# EAGLE schematic ION-60 (EAGLE 6.5.0)
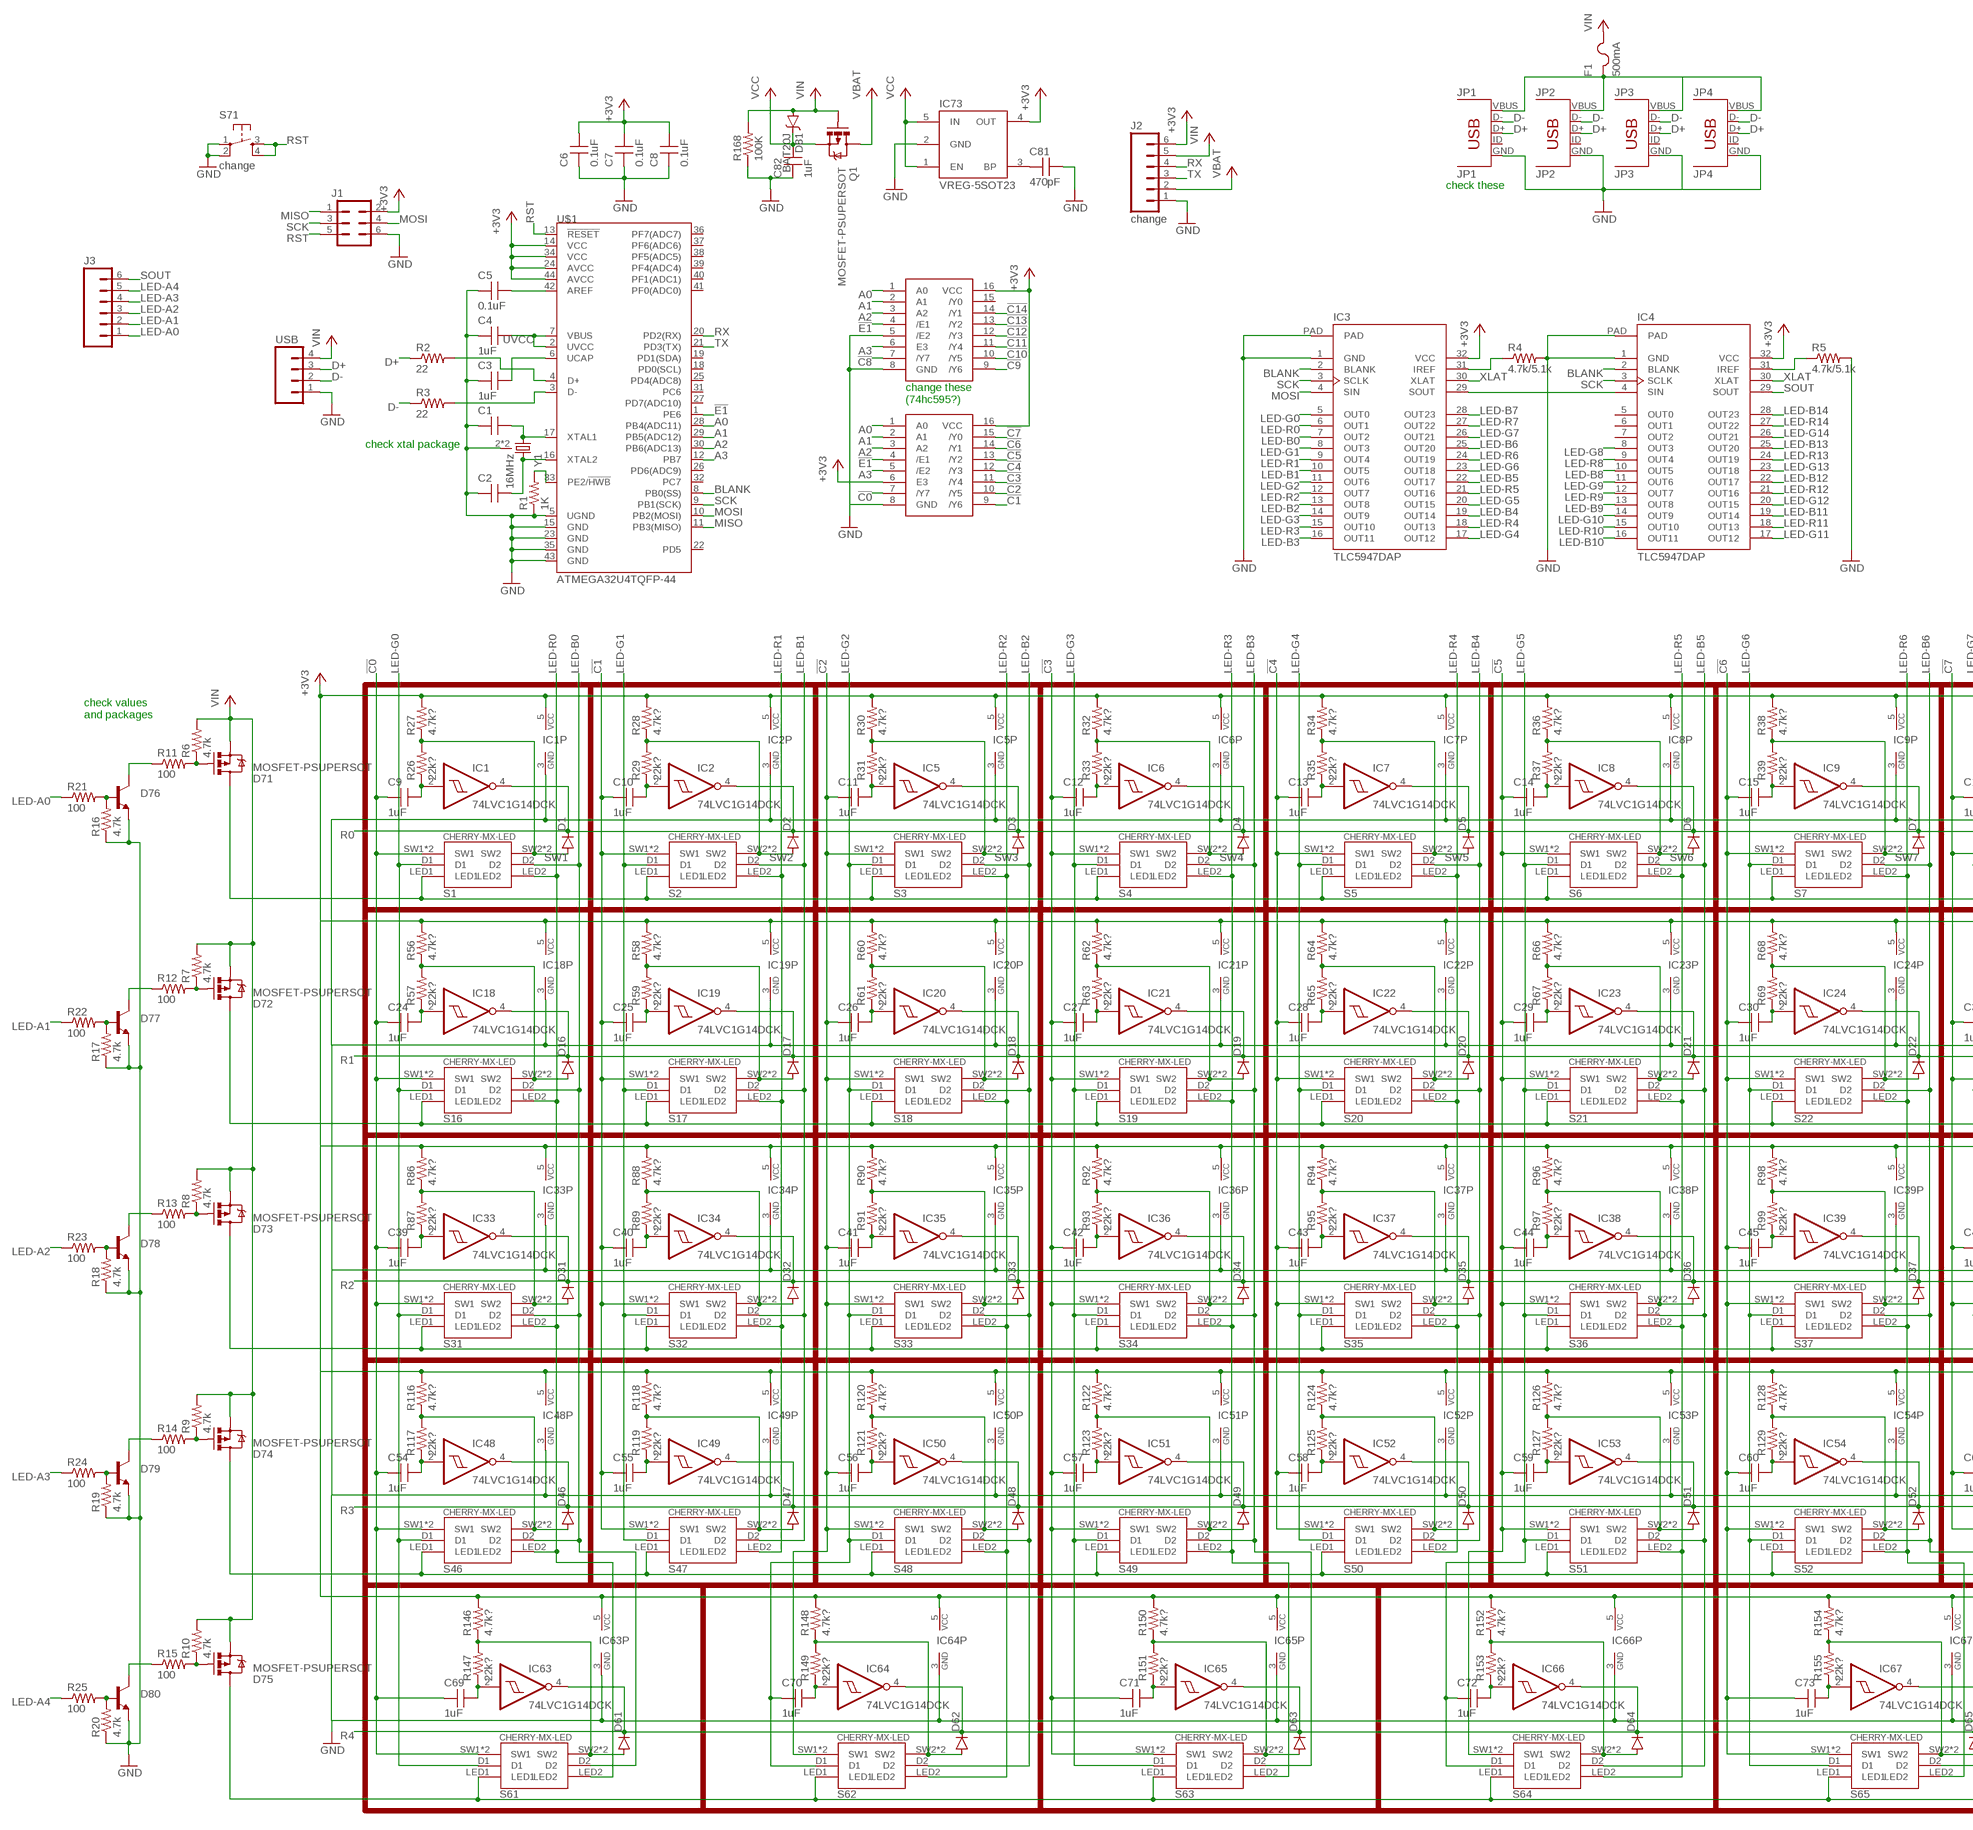
[diagram p0: schematic, sheet 1, part 1 of 2]
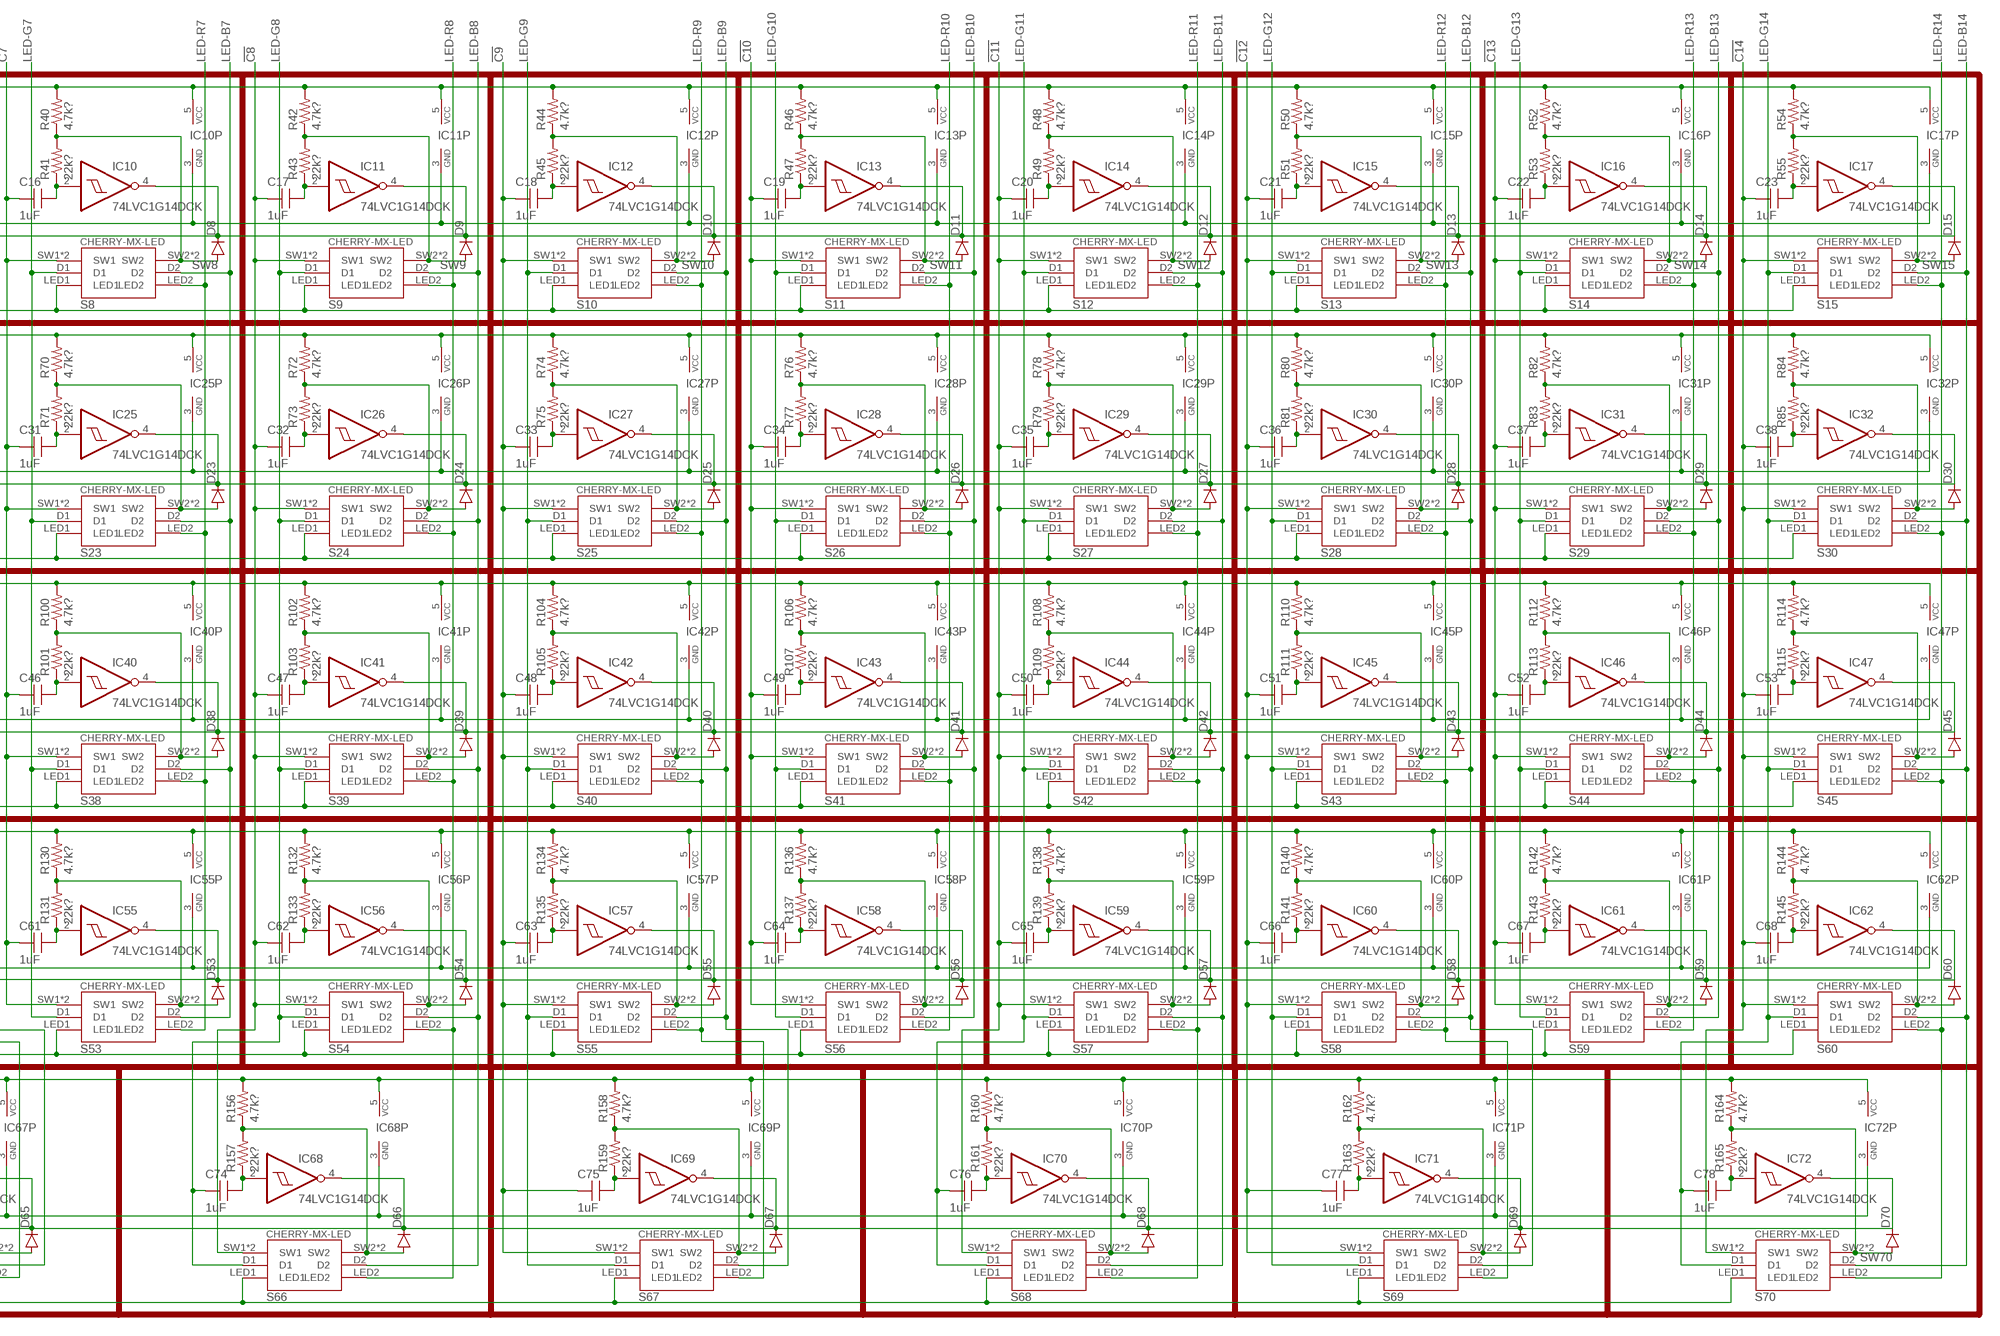
[diagram p1: schematic, sheet 1, part 2 of 2]

## Parts
C1  CAPACITOR0603  [C0603]
C2  CAPACITOR0603  [C0603]
C3  1uF  CAPACITOR0603  [C0603]
C4  1uF  CAPACITOR0603  [C0603]
C5  0.1uF  CAPACITOR0603  [C0603]
C6  0.1uF  CAPACITOR0603  [C0603]
C7  0.1uF  CAPACITOR0603  [C0603]
C8  0.1uF  CAPACITOR0603  [C0603]
C9  1uF  CAPACITOR0603  [C0603]
C10  1uF  CAPACITOR0603  [C0603]
C11  1uF  CAPACITOR0603  [C0603]
C12  1uF  CAPACITOR0603  [C0603]
C13  1uF  CAPACITOR0603  [C0603]
C14  1uF  CAPACITOR0603  [C0603]
C15  1uF  CAPACITOR0603  [C0603]
C16  1uF  CAPACITOR0603  [C0603]
C17  1uF  CAPACITOR0603  [C0603]
C18  1uF  CAPACITOR0603  [C0603]
C19  1uF  CAPACITOR0603  [C0603]
C20  1uF  CAPACITOR0603  [C0603]
C21  1uF  CAPACITOR0603  [C0603]
C22  1uF  CAPACITOR0603  [C0603]
C23  1uF  CAPACITOR0603  [C0603]
C24  1uF  CAPACITOR0603  [C0603]
C25  1uF  CAPACITOR0603  [C0603]
C26  1uF  CAPACITOR0603  [C0603]
C27  1uF  CAPACITOR0603  [C0603]
C28  1uF  CAPACITOR0603  [C0603]
C29  1uF  CAPACITOR0603  [C0603]
C30  1uF  CAPACITOR0603  [C0603]
C31  1uF  CAPACITOR0603  [C0603]
C32  1uF  CAPACITOR0603  [C0603]
C33  1uF  CAPACITOR0603  [C0603]
C34  1uF  CAPACITOR0603  [C0603]
C35  1uF  CAPACITOR0603  [C0603]
C36  1uF  CAPACITOR0603  [C0603]
C37  1uF  CAPACITOR0603  [C0603]
C38  1uF  CAPACITOR0603  [C0603]
C39  1uF  CAPACITOR0603  [C0603]
C40  1uF  CAPACITOR0603  [C0603]
C41  1uF  CAPACITOR0603  [C0603]
C42  1uF  CAPACITOR0603  [C0603]
C43  1uF  CAPACITOR0603  [C0603]
C44  1uF  CAPACITOR0603  [C0603]
C45  1uF  CAPACITOR0603  [C0603]
C46  1uF  CAPACITOR0603  [C0603]
C47  1uF  CAPACITOR0603  [C0603]
C48  1uF  CAPACITOR0603  [C0603]
C49  1uF  CAPACITOR0603  [C0603]
C50  1uF  CAPACITOR0603  [C0603]
C51  1uF  CAPACITOR0603  [C0603]
C52  1uF  CAPACITOR0603  [C0603]
C53  1uF  CAPACITOR0603  [C0603]
C54  1uF  CAPACITOR0603  [C0603]
C55  1uF  CAPACITOR0603  [C0603]
C56  1uF  CAPACITOR0603  [C0603]
C57  1uF  CAPACITOR0603  [C0603]
C58  1uF  CAPACITOR0603  [C0603]
C59  1uF  CAPACITOR0603  [C0603]
C60  1uF  CAPACITOR0603  [C0603]
C61  1uF  CAPACITOR0603  [C0603]
C62  1uF  CAPACITOR0603  [C0603]
C63  1uF  CAPACITOR0603  [C0603]
C64  1uF  CAPACITOR0603  [C0603]
C65  1uF  CAPACITOR0603  [C0603]
C66  1uF  CAPACITOR0603  [C0603]
C67  1uF  CAPACITOR0603  [C0603]
C68  1uF  CAPACITOR0603  [C0603]
C69  1uF  CAPACITOR0603  [C0603]
C70  1uF  CAPACITOR0603  [C0603]
C71  1uF  CAPACITOR0603  [C0603]
C72  1uF  CAPACITOR0603  [C0603]
C73  1uF  CAPACITOR0603  [C0603]
C74  1uF  CAPACITOR0603  [C0603]
C75  1uF  CAPACITOR0603  [C0603]
C76  1uF  CAPACITOR0603  [C0603]
C77  1uF  CAPACITOR0603  [C0603]
C78  1uF  CAPACITOR0603  [C0603]
C81  470pF  CAPACITOR0603  [C0603]
C82  1uF  CAPACITOR0603  [C0603]
D1  DIODESOD123  [SOD-123]
D2  DIODESOD123  [SOD-123]
D3  DIODESOD123  [SOD-123]
D4  DIODESOD123  [SOD-123]
D5  DIODESOD123  [SOD-123]
D6  DIODESOD123  [SOD-123]
D7  DIODESOD123  [SOD-123]
D8  DIODESOD123  [SOD-123]
D9  DIODESOD123  [SOD-123]
D10  DIODESOD123  [SOD-123]
D11  DIODESOD123  [SOD-123]
D12  DIODESOD123  [SOD-123]
D13  DIODESOD123  [SOD-123]
D14  DIODESOD123  [SOD-123]
D15  DIODESOD123  [SOD-123]
D16  DIODESOD123  [SOD-123]
D17  DIODESOD123  [SOD-123]
D18  DIODESOD123  [SOD-123]
D19  DIODESOD123  [SOD-123]
D20  DIODESOD123  [SOD-123]
D21  DIODESOD123  [SOD-123]
D22  DIODESOD123  [SOD-123]
D23  DIODESOD123  [SOD-123]
D24  DIODESOD123  [SOD-123]
D25  DIODESOD123  [SOD-123]
D26  DIODESOD123  [SOD-123]
D27  DIODESOD123  [SOD-123]
D28  DIODESOD123  [SOD-123]
D29  DIODESOD123  [SOD-123]
D30  DIODESOD123  [SOD-123]
D31  DIODESOD123  [SOD-123]
D32  DIODESOD123  [SOD-123]
D33  DIODESOD123  [SOD-123]
D34  DIODESOD123  [SOD-123]
D35  DIODESOD123  [SOD-123]
D36  DIODESOD123  [SOD-123]
D37  DIODESOD123  [SOD-123]
D38  DIODESOD123  [SOD-123]
D39  DIODESOD123  [SOD-123]
D40  DIODESOD123  [SOD-123]
D41  DIODESOD123  [SOD-123]
D42  DIODESOD123  [SOD-123]
D43  DIODESOD123  [SOD-123]
D44  DIODESOD123  [SOD-123]
D45  DIODESOD123  [SOD-123]
D46  DIODESOD123  [SOD-123]
D47  DIODESOD123  [SOD-123]
D48  DIODESOD123  [SOD-123]
D49  DIODESOD123  [SOD-123]
D50  DIODESOD123  [SOD-123]
D51  DIODESOD123  [SOD-123]
D52  DIODESOD123  [SOD-123]
D53  DIODESOD123  [SOD-123]
D54  DIODESOD123  [SOD-123]
D55  DIODESOD123  [SOD-123]
D56  DIODESOD123  [SOD-123]
D57  DIODESOD123  [SOD-123]
D58  DIODESOD123  [SOD-123]
D59  DIODESOD123  [SOD-123]
D60  DIODESOD123  [SOD-123]
D61  DIODESOD123  [SOD-123]
D62  DIODESOD123  [SOD-123]
D63  DIODESOD123  [SOD-123]
D64  DIODESOD123  [SOD-123]
D65  DIODESOD123  [SOD-123]
D66  DIODESOD123  [SOD-123]
D67  DIODESOD123  [SOD-123]
D68  DIODESOD123  [SOD-123]
D69  DIODESOD123  [SOD-123]
D70  DIODESOD123  [SOD-123]
D71  MOSFET-PSUPERSOT  [SUPERSOT-3]
D72  MOSFET-PSUPERSOT  [SUPERSOT-3]
D73  MOSFET-PSUPERSOT  [SUPERSOT-3]
D74  MOSFET-PSUPERSOT  [SUPERSOT-3]
D75  MOSFET-PSUPERSOT  [SUPERSOT-3]
D76  BSS138SOT23  [SOT23]
D77  BSS138SOT23  [SOT23]
D78  BSS138SOT23  [SOT23]
D79  BSS138SOT23  [SOT23]
D80  BSS138SOT23  [SOT23]
D81  BAT20J  DIODE-SCHOTTKY-BAT20J  [SOD-323]
F1  500mA  FUSESMD-1812  [FUSE-1812]
IC1  74LVC1G14DCK  [SC70-5]
IC2  74LVC1G14DCK  [SC70-5]
IC3  TLC5947DAP  [HTSSOP-32]
IC4  TLC5947DAP  [HTSSOP-32]
IC5  74LVC1G14DCK  [SC70-5]
IC6  74LVC1G14DCK  [SC70-5]
IC7  74LVC1G14DCK  [SC70-5]
IC8  74LVC1G14DCK  [SC70-5]
IC9  74LVC1G14DCK  [SC70-5]
IC10  74LVC1G14DCK  [SC70-5]
IC11  74LVC1G14DCK  [SC70-5]
IC12  74LVC1G14DCK  [SC70-5]
IC13  74LVC1G14DCK  [SC70-5]
IC14  74LVC1G14DCK  [SC70-5]
IC15  74LVC1G14DCK  [SC70-5]
IC16  74LVC1G14DCK  [SC70-5]
IC17  74LVC1G14DCK  [SC70-5]
IC18  74LVC1G14DCK  [SC70-5]
IC19  74LVC1G14DCK  [SC70-5]
IC20  74LVC1G14DCK  [SC70-5]
IC21  74LVC1G14DCK  [SC70-5]
IC22  74LVC1G14DCK  [SC70-5]
IC23  74LVC1G14DCK  [SC70-5]
IC24  74LVC1G14DCK  [SC70-5]
IC25  74LVC1G14DCK  [SC70-5]
IC26  74LVC1G14DCK  [SC70-5]
IC27  74LVC1G14DCK  [SC70-5]
IC28  74LVC1G14DCK  [SC70-5]
IC29  74LVC1G14DCK  [SC70-5]
IC30  74LVC1G14DCK  [SC70-5]
IC31  74LVC1G14DCK  [SC70-5]
IC32  74LVC1G14DCK  [SC70-5]
IC33  74LVC1G14DCK  [SC70-5]
IC34  74LVC1G14DCK  [SC70-5]
IC35  74LVC1G14DCK  [SC70-5]
IC36  74LVC1G14DCK  [SC70-5]
IC37  74LVC1G14DCK  [SC70-5]
IC38  74LVC1G14DCK  [SC70-5]
IC39  74LVC1G14DCK  [SC70-5]
IC40  74LVC1G14DCK  [SC70-5]
IC41  74LVC1G14DCK  [SC70-5]
IC42  74LVC1G14DCK  [SC70-5]
IC43  74LVC1G14DCK  [SC70-5]
IC44  74LVC1G14DCK  [SC70-5]
IC45  74LVC1G14DCK  [SC70-5]
IC46  74LVC1G14DCK  [SC70-5]
IC47  74LVC1G14DCK  [SC70-5]
IC48  74LVC1G14DCK  [SC70-5]
IC49  74LVC1G14DCK  [SC70-5]
IC50  74LVC1G14DCK  [SC70-5]
IC51  74LVC1G14DCK  [SC70-5]
IC52  74LVC1G14DCK  [SC70-5]
IC53  74LVC1G14DCK  [SC70-5]
IC54  74LVC1G14DCK  [SC70-5]
IC55  74LVC1G14DCK  [SC70-5]
IC56  74LVC1G14DCK  [SC70-5]
IC57  74LVC1G14DCK  [SC70-5]
IC58  74LVC1G14DCK  [SC70-5]
IC59  74LVC1G14DCK  [SC70-5]
IC60  74LVC1G14DCK  [SC70-5]
IC61  74LVC1G14DCK  [SC70-5]
IC62  74LVC1G14DCK  [SC70-5]
IC63  74LVC1G14DCK  [SC70-5]
IC64  74LVC1G14DCK  [SC70-5]
IC65  74LVC1G14DCK  [SC70-5]
IC66  74LVC1G14DCK  [SC70-5]
IC67  74LVC1G14DCK  [SC70-5]
IC68  74LVC1G14DCK  [SC70-5]
IC69  74LVC1G14DCK  [SC70-5]
IC70  74LVC1G14DCK  [SC70-5]
IC71  74LVC1G14DCK  [SC70-5]
IC72  74LVC1G14DCK  [SC70-5]
IC73  VREG-5SOT23  [SOT23-5]
J1  2X03M-0.1-PTH-SHROUDED  [M-2X03-0.1-PTH-SHROUDED]
J2  change  1X06M-0.05-PTH  [M-1X06-0.05-PTH]
J3  1X06M-0.1-PTH  [M-1X06-0.1-PTH]
JP1  USB-MICROBSMD  [USB-MICRO-B-SMD]
JP2  USB-MICROBSMD  [USB-MICRO-B-SMD]
JP3  USB-MICROBSMD  [USB-MICRO-B-SMD]
JP4  USB-MICROBSMD  [USB-MICRO-B-SMD]
Q1  MOSFET-PSUPERSOT  [SUPERSOT-3]
R1  1K  RESISTOR0603  [R0603]
R2  22  RESISTOR0603  [R0603]
R3  22  RESISTOR0603  [R0603]
R4  4.7k/5.1k  RESISTOR0603  [R0603]
R5  4.7k/5.1k  RESISTOR0603  [R0603]
R6  4.7k  RESISTOR0603  [R0603]
R7  4.7k  RESISTOR0603  [R0603]
R8  4.7k  RESISTOR0603  [R0603]
R9  4.7k  RESISTOR0603  [R0603]
R10  4.7k  RESISTOR0603  [R0603]
R11  100  RESISTOR0603  [R0603]
R12  100  RESISTOR0603  [R0603]
R13  100  RESISTOR0603  [R0603]
R14  100  RESISTOR0603  [R0603]
R15  100  RESISTOR0603  [R0603]
R16  4.7k  RESISTOR0603  [R0603]
R17  4.7k  RESISTOR0603  [R0603]
R18  4.7k  RESISTOR0603  [R0603]
R19  4.7k  RESISTOR0603  [R0603]
R20  4.7k  RESISTOR0603  [R0603]
R21  100  RESISTOR0603  [R0603]
R22  100  RESISTOR0603  [R0603]
R23  100  RESISTOR0603  [R0603]
R24  100  RESISTOR0603  [R0603]
R25  100  RESISTOR0603  [R0603]
R26  22k?  RESISTOR0603  [R0603]
R27  4.7k?  RESISTOR0603  [R0603]
R28  4.7k?  RESISTOR0603  [R0603]
R29  22k?  RESISTOR0603  [R0603]
R30  4.7k?  RESISTOR0603  [R0603]
R31  22k?  RESISTOR0603  [R0603]
R32  4.7k?  RESISTOR0603  [R0603]
R33  22k?  RESISTOR0603  [R0603]
R34  4.7k?  RESISTOR0603  [R0603]
R35  22k?  RESISTOR0603  [R0603]
R36  4.7k?  RESISTOR0603  [R0603]
R37  22k?  RESISTOR0603  [R0603]
R38  4.7k?  RESISTOR0603  [R0603]
R39  22k?  RESISTOR0603  [R0603]
R40  4.7k?  RESISTOR0603  [R0603]
R41  22k?  RESISTOR0603  [R0603]
R42  4.7k?  RESISTOR0603  [R0603]
R43  22k?  RESISTOR0603  [R0603]
R44  4.7k?  RESISTOR0603  [R0603]
R45  22k?  RESISTOR0603  [R0603]
R46  4.7k?  RESISTOR0603  [R0603]
R47  22k?  RESISTOR0603  [R0603]
R48  4.7k?  RESISTOR0603  [R0603]
R49  22k?  RESISTOR0603  [R0603]
R50  4.7k?  RESISTOR0603  [R0603]
R51  22k?  RESISTOR0603  [R0603]
R52  4.7k?  RESISTOR0603  [R0603]
R53  22k?  RESISTOR0603  [R0603]
R54  4.7k?  RESISTOR0603  [R0603]
R55  22k?  RESISTOR0603  [R0603]
R56  4.7k?  RESISTOR0603  [R0603]
R57  22k?  RESISTOR0603  [R0603]
R58  4.7k?  RESISTOR0603  [R0603]
R59  22k?  RESISTOR0603  [R0603]
R60  4.7k?  RESISTOR0603  [R0603]
R61  22k?  RESISTOR0603  [R0603]
R62  4.7k?  RESISTOR0603  [R0603]
R63  22k?  RESISTOR0603  [R0603]
R64  4.7k?  RESISTOR0603  [R0603]
R65  22k?  RESISTOR0603  [R0603]
R66  4.7k?  RESISTOR0603  [R0603]
R67  22k?  RESISTOR0603  [R0603]
R68  4.7k?  RESISTOR0603  [R0603]
R69  22k?  RESISTOR0603  [R0603]
R70  4.7k?  RESISTOR0603  [R0603]
R71  22k?  RESISTOR0603  [R0603]
R72  4.7k?  RESISTOR0603  [R0603]
R73  22k?  RESISTOR0603  [R0603]
R74  4.7k?  RESISTOR0603  [R0603]
R75  22k?  RESISTOR0603  [R0603]
R76  4.7k?  RESISTOR0603  [R0603]
R77  22k?  RESISTOR0603  [R0603]
R78  4.7k?  RESISTOR0603  [R0603]
R79  22k?  RESISTOR0603  [R0603]
R80  4.7k?  RESISTOR0603  [R0603]
R81  22k?  RESISTOR0603  [R0603]
R82  4.7k?  RESISTOR0603  [R0603]
R83  22k?  RESISTOR0603  [R0603]
R84  4.7k?  RESISTOR0603  [R0603]
R85  22k?  RESISTOR0603  [R0603]
R86  4.7k?  RESISTOR0603  [R0603]
R87  22k?  RESISTOR0603  [R0603]
R88  4.7k?  RESISTOR0603  [R0603]
R89  22k?  RESISTOR0603  [R0603]
R90  4.7k?  RESISTOR0603  [R0603]
R91  22k?  RESISTOR0603  [R0603]
R92  4.7k?  RESISTOR0603  [R0603]
R93  22k?  RESISTOR0603  [R0603]
R94  4.7k?  RESISTOR0603  [R0603]
R95  22k?  RESISTOR0603  [R0603]
R96  4.7k?  RESISTOR0603  [R0603]
R97  22k?  RESISTOR0603  [R0603]
R98  4.7k?  RESISTOR0603  [R0603]
R99  22k?  RESISTOR0603  [R0603]
R100  4.7k?  RESISTOR0603  [R0603]
R101  22k?  RESISTOR0603  [R0603]
R102  4.7k?  RESISTOR0603  [R0603]
R103  22k?  RESISTOR0603  [R0603]
R104  4.7k?  RESISTOR0603  [R0603]
R105  22k?  RESISTOR0603  [R0603]
R106  4.7k?  RESISTOR0603  [R0603]
R107  22k?  RESISTOR0603  [R0603]
R108  4.7k?  RESISTOR0603  [R0603]
R109  22k?  RESISTOR0603  [R0603]
R110  4.7k?  RESISTOR0603  [R0603]
R111  22k?  RESISTOR0603  [R0603]
R112  4.7k?  RESISTOR0603  [R0603]
R113  22k?  RESISTOR0603  [R0603]
R114  4.7k?  RESISTOR0603  [R0603]
R115  22k?  RESISTOR0603  [R0603]
R116  4.7k?  RESISTOR0603  [R0603]
R117  22k?  RESISTOR0603  [R0603]
R118  4.7k?  RESISTOR0603  [R0603]
R119  22k?  RESISTOR0603  [R0603]
R120  4.7k?  RESISTOR0603  [R0603]
R121  22k?  RESISTOR0603  [R0603]
R122  4.7k?  RESISTOR0603  [R0603]
R123  22k?  RESISTOR0603  [R0603]
R124  4.7k?  RESISTOR0603  [R0603]
R125  22k?  RESISTOR0603  [R0603]
R126  4.7k?  RESISTOR0603  [R0603]
R127  22k?  RESISTOR0603  [R0603]
R128  4.7k?  RESISTOR0603  [R0603]
R129  22k?  RESISTOR0603  [R0603]
R130  4.7k?  RESISTOR0603  [R0603]
R131  22k?  RESISTOR0603  [R0603]
R132  4.7k?  RESISTOR0603  [R0603]
R133  22k?  RESISTOR0603  [R0603]
R134  4.7k?  RESISTOR0603  [R0603]
R135  22k?  RESISTOR0603  [R0603]
R136  4.7k?  RESISTOR0603  [R0603]
R137  22k?  RESISTOR0603  [R0603]
R138  4.7k?  RESISTOR0603  [R0603]
R139  22k?  RESISTOR0603  [R0603]
R140  4.7k?  RESISTOR0603  [R0603]
R141  22k?  RESISTOR0603  [R0603]
R142  4.7k?  RESISTOR0603  [R0603]
R143  22k?  RESISTOR0603  [R0603]
R144  4.7k?  RESISTOR0603  [R0603]
R145  22k?  RESISTOR0603  [R0603]
R146  4.7k?  RESISTOR0603  [R0603]
R147  22k?  RESISTOR0603  [R0603]
R148  4.7k?  RESISTOR0603  [R0603]
R149  22k?  RESISTOR0603  [R0603]
R150  4.7k?  RESISTOR0603  [R0603]
R151  22k?  RESISTOR0603  [R0603]
R152  4.7k?  RESISTOR0603  [R0603]
R153  22k?  RESISTOR0603  [R0603]
R154  4.7k?  RESISTOR0603  [R0603]
R155  22k?  RESISTOR0603  [R0603]
R156  4.7k?  RESISTOR0603  [R0603]
R157  22k?  RESISTOR0603  [R0603]
R158  4.7k?  RESISTOR0603  [R0603]
R159  22k?  RESISTOR0603  [R0603]
R160  4.7k?  RESISTOR0603  [R0603]
R161  22k?  RESISTOR0603  [R0603]
R162  4.7k?  RESISTOR0603  [R0603]
R163  22k?  RESISTOR0603  [R0603]
R164  4.7k?  RESISTOR0603  [R0603]
R165  22k?  RESISTOR0603  [R0603]
R168  100K  RESISTOR0603  [R0603]
S1  CHERRY-MX-LED1X1  [CHERRY-MX-LED-1X1]
S2  CHERRY-MX-LED1X1  [CHERRY-MX-LED-1X1]
S3  CHERRY-MX-LED1X1  [CHERRY-MX-LED-1X1]
S4  CHERRY-MX-LED1X1  [CHERRY-MX-LED-1X1]
S5  CHERRY-MX-LED1X1  [CHERRY-MX-LED-1X1]
S6  CHERRY-MX-LED1X1  [CHERRY-MX-LED-1X1]
S7  CHERRY-MX-LED1X1  [CHERRY-MX-LED-1X1]
S8  CHERRY-MX-LED1X1  [CHERRY-MX-LED-1X1]
S9  CHERRY-MX-LED1X1  [CHERRY-MX-LED-1X1]
S10  CHERRY-MX-LED1X1  [CHERRY-MX-LED-1X1]
S11  CHERRY-MX-LED1X1  [CHERRY-MX-LED-1X1]
S12  CHERRY-MX-LED1X1  [CHERRY-MX-LED-1X1]
S13  CHERRY-MX-LED1X1  [CHERRY-MX-LED-1X1]
S14  CHERRY-MX-LED1X1  [CHERRY-MX-LED-1X1]
S15  CHERRY-MX-LED1X1  [CHERRY-MX-LED-1X1]
S16  CHERRY-MX-LED1X1  [CHERRY-MX-LED-1X1]
S17  CHERRY-MX-LED1X1  [CHERRY-MX-LED-1X1]
S18  CHERRY-MX-LED1X1  [CHERRY-MX-LED-1X1]
S19  CHERRY-MX-LED1X1  [CHERRY-MX-LED-1X1]
S20  CHERRY-MX-LED1X1  [CHERRY-MX-LED-1X1]
S21  CHERRY-MX-LED1X1  [CHERRY-MX-LED-1X1]
S22  CHERRY-MX-LED1X1  [CHERRY-MX-LED-1X1]
S23  CHERRY-MX-LED1X1  [CHERRY-MX-LED-1X1]
S24  CHERRY-MX-LED1X1  [CHERRY-MX-LED-1X1]
S25  CHERRY-MX-LED1X1  [CHERRY-MX-LED-1X1]
S26  CHERRY-MX-LED1X1  [CHERRY-MX-LED-1X1]
S27  CHERRY-MX-LED1X1  [CHERRY-MX-LED-1X1]
S28  CHERRY-MX-LED1X1  [CHERRY-MX-LED-1X1]
S29  CHERRY-MX-LED1X1  [CHERRY-MX-LED-1X1]
S30  CHERRY-MX-LED1X1  [CHERRY-MX-LED-1X1]
S31  CHERRY-MX-LED1X1  [CHERRY-MX-LED-1X1]
S32  CHERRY-MX-LED1X1  [CHERRY-MX-LED-1X1]
S33  CHERRY-MX-LED1X1  [CHERRY-MX-LED-1X1]
S34  CHERRY-MX-LED1X1  [CHERRY-MX-LED-1X1]
S35  CHERRY-MX-LED1X1  [CHERRY-MX-LED-1X1]
S36  CHERRY-MX-LED1X1  [CHERRY-MX-LED-1X1]
S37  CHERRY-MX-LED1X1  [CHERRY-MX-LED-1X1]
S38  CHERRY-MX-LED1X1  [CHERRY-MX-LED-1X1]
S39  CHERRY-MX-LED1X1  [CHERRY-MX-LED-1X1]
S40  CHERRY-MX-LED1X1  [CHERRY-MX-LED-1X1]
S41  CHERRY-MX-LED1X1  [CHERRY-MX-LED-1X1]
S42  CHERRY-MX-LED1X1  [CHERRY-MX-LED-1X1]
S43  CHERRY-MX-LED1X1  [CHERRY-MX-LED-1X1]
S44  CHERRY-MX-LED1X1  [CHERRY-MX-LED-1X1]
S45  CHERRY-MX-LED1X1  [CHERRY-MX-LED-1X1]
S46  CHERRY-MX-LED1X1  [CHERRY-MX-LED-1X1]
S47  CHERRY-MX-LED1X1  [CHERRY-MX-LED-1X1]
S48  CHERRY-MX-LED1X1  [CHERRY-MX-LED-1X1]
S49  CHERRY-MX-LED1X1  [CHERRY-MX-LED-1X1]
S50  CHERRY-MX-LED1X1  [CHERRY-MX-LED-1X1]
S51  CHERRY-MX-LED1X1  [CHERRY-MX-LED-1X1]
S52  CHERRY-MX-LED1X1  [CHERRY-MX-LED-1X1]
S53  CHERRY-MX-LED1X1  [CHERRY-MX-LED-1X1]
S54  CHERRY-MX-LED1X1  [CHERRY-MX-LED-1X1]
S55  CHERRY-MX-LED1X1  [CHERRY-MX-LED-1X1]
S56  CHERRY-MX-LED1X1  [CHERRY-MX-LED-1X1]
S57  CHERRY-MX-LED1X1  [CHERRY-MX-LED-1X1]
S58  CHERRY-MX-LED1X1  [CHERRY-MX-LED-1X1]
S59  CHERRY-MX-LED1X1  [CHERRY-MX-LED-1X1]
S60  CHERRY-MX-LED1X1  [CHERRY-MX-LED-1X1]
S61  CHERRY-MX-LED1X1.5  [CHERRY-MX-LED-1X1.5]
S62  CHERRY-MX-LED1X1.5  [CHERRY-MX-LED-1X1.5]
S63  CHERRY-MX-LED1X1.5  [CHERRY-MX-LED-1X1.5]
S64  CHERRY-MX-LED1X1.5  [CHERRY-MX-LED-1X1.5]
S65  CHERRY-MX-LED1X1.5  [CHERRY-MX-LED-1X1.5]
S66  CHERRY-MX-LED1X1.5  [CHERRY-MX-LED-1X1.5]
S67  CHERRY-MX-LED1X1.5  [CHERRY-MX-LED-1X1.5]
S68  CHERRY-MX-LED1X1.5  [CHERRY-MX-LED-1X1.5]
S69  CHERRY-MX-LED1X1.5  [CHERRY-MX-LED-1X1.5]
S70  CHERRY-MX-LED1X1.5  [CHERRY-MX-LED-1X1.5]
S71  change  SWITCH-TACTILESMD  [SWITCH-TACTILE-SMD]
U$1  ATMEGA32U4TQFP-44  [TQFP44]
U$2  74LVC138AD  [SO016]
U$3  74LVC138AD  [SO016]
USB  1X04M-0.1-PTH  [M-1X04-0.1-PTH]
Y1  16MHz  CRYSTAL  [CRYSTAL-SMD-3.2X2.5]

## Nets
!C0: C9.1 C24.1 C39.1 C54.1 C69.1 S1.SW1 S1.SW3(SW1) S16.SW1 S16.SW3(SW1) S31.SW1 S31.SW3(SW1) S46.SW1 S46.SW3(SW1) S61.SW1 S61.SW3(SW1) U$2.7(/Y7)
!C1: C10.1 C25.1 C40.1 C55.1 S2.SW1 S2.SW3(SW1) S17.SW1 S17.SW3(SW1) S32.SW1 S32.SW3(SW1) S47.SW1 S47.SW3(SW1) U$2.9(/Y6)
!C2: C11.1 C26.1 C41.1 C56.1 S3.SW1 S3.SW3(SW1) S18.SW1 S18.SW3(SW1) S33.SW1 S33.SW3(SW1) S48.SW1 S48.SW3(SW1) S62.SW1 S62.SW3(SW1) U$2.10(/Y5)
!C3: C12.1 C27.1 C42.1 C57.1 C71.1 S4.SW1 S4.SW3(SW1) S19.SW1 S19.SW3(SW1) S34.SW1 S34.SW3(SW1) S49.SW1 S49.SW3(SW1) S63.SW1 S63.SW3(SW1) U$2.11(/Y4)
!C4: C13.1 C28.1 C43.1 C58.1 S5.SW1 S5.SW3(SW1) S20.SW1 S20.SW3(SW1) S35.SW1 S35.SW3(SW1) S50.SW1 S50.SW3(SW1) U$2.12(/Y3)
!C5: C14.1 C29.1 C44.1 C59.1 S6.SW1 S6.SW3(SW1) S21.SW1 S21.SW3(SW1) S36.SW1 S36.SW3(SW1) S51.SW1 S51.SW3(SW1) S64.SW1 S64.SW3(SW1) U$2.13(/Y2)
!C6: C15.1 C30.1 C45.1 C60.1 C73.1 S7.SW1 S7.SW3(SW1) S22.SW1 S22.SW3(SW1) S37.SW1 S37.SW3(SW1) S52.SW1 S52.SW3(SW1) S65.SW1 S65.SW3(SW1) U$2.14(/Y1)
!C7: C16.1 C31.1 C46.1 C61.1 S8.SW1 S8.SW3(SW1) S23.SW1 S23.SW3(SW1) S38.SW1 S38.SW3(SW1) S53.SW1 S53.SW3(SW1) U$2.15(/Y0)
!C8: C17.1 C32.1 C47.1 C62.1 S9.SW1 S9.SW3(SW1) S24.SW1 S24.SW3(SW1) S39.SW1 S39.SW3(SW1) S54.SW1 S54.SW3(SW1) S66.SW1 S66.SW3(SW1) U$3.7(/Y7)
!C9: C18.1 C33.1 C48.1 C63.1 C75.1 S10.SW1 S10.SW3(SW1) S25.SW1 S25.SW3(SW1) S40.SW1 S40.SW3(SW1) S55.SW1 S55.SW3(SW1) S67.SW1 S67.SW3(SW1) U$3.9(/Y6)
!C10: C19.1 C34.1 C49.1 C64.1 S11.SW1 S11.SW3(SW1) S26.SW1 S26.SW3(SW1) S41.SW1 S41.SW3(SW1) S56.SW1 S56.SW3(SW1) U$3.10(/Y5)
!C11: C20.1 C35.1 C50.1 C65.1 S12.SW1 S12.SW3(SW1) S27.SW1 S27.SW3(SW1) S42.SW1 S42.SW3(SW1) S57.SW1 S57.SW3(SW1) S68.SW1 S68.SW3(SW1) U$3.11(/Y4)
!C12: C21.1 C36.1 C51.1 C66.1 C77.1 S13.SW1 S13.SW3(SW1) S28.SW1 S28.SW3(SW1) S43.SW1 S43.SW3(SW1) S58.SW1 S58.SW3(SW1) S69.SW1 S69.SW3(SW1) U$3.12(/Y3)
!C13: C22.1 C37.1 C52.1 C67.1 S14.SW1 S14.SW3(SW1) S29.SW1 S29.SW3(SW1) S44.SW1 S44.SW3(SW1) S59.SW1 S59.SW3(SW1) U$3.13(/Y2)
!C14: C23.1 C38.1 C53.1 C68.1 S15.SW1 S15.SW3(SW1) S30.SW1 S30.SW3(SW1) S45.SW1 S45.SW3(SW1) S60.SW1 S60.SW3(SW1) S70.SW1 S70.SW3(SW1) U$3.14(/Y1)
!COL: C9.2 IC1.2(I) R26.1
!COL1: C10.2 IC2.2(I) R29.1
!COL2: C11.2 IC5.2(I) R31.1
!COL3: C12.2 IC6.2(I) R33.1
!COL4: C13.2 IC7.2(I) R35.1
!COL5: C14.2 IC8.2(I) R37.1
!COL6: C15.2 IC9.2(I) R39.1
!COL7: C16.2 IC10.2(I) R41.1
!COL8: C17.2 IC11.2(I) R43.1
!COL9: C18.2 IC12.2(I) R45.1
!COL10: C19.2 IC13.2(I) R47.1
!COL11: C20.2 IC14.2(I) R49.1
!COL12: C21.2 IC15.2(I) R51.1
!COL13: C22.2 IC16.2(I) R53.1
!COL14: C23.2 IC17.2(I) R55.1
!COL15: C24.2 IC18.2(I) R57.1
!COL16: C25.2 IC19.2(I) R59.1
!COL17: C26.2 IC20.2(I) R61.1
!COL18: C27.2 IC21.2(I) R63.1
!COL19: C28.2 IC22.2(I) R65.1
!COL20: C29.2 IC23.2(I) R67.1
!COL21: C30.2 IC24.2(I) R69.1
!COL22: C31.2 IC25.2(I) R71.1
!COL23: C32.2 IC26.2(I) R73.1
!COL24: C33.2 IC27.2(I) R75.1
!COL25: C34.2 IC28.2(I) R77.1
!COL26: C35.2 IC29.2(I) R79.1
!COL27: C36.2 IC30.2(I) R81.1
!COL28: C37.2 IC31.2(I) R83.1
!COL29: C38.2 IC32.2(I) R85.1
!COL30: C39.2 IC33.2(I) R87.1
!COL31: C40.2 IC34.2(I) R89.1
!COL32: C41.2 IC35.2(I) R91.1
!COL33: C42.2 IC36.2(I) R93.1
!COL34: C43.2 IC37.2(I) R95.1
!COL35: C44.2 IC38.2(I) R97.1
!COL36: C45.2 IC39.2(I) R99.1
!COL37: C46.2 IC40.2(I) R101.1
!COL38: C47.2 IC41.2(I) R103.1
!COL39: C48.2 IC42.2(I) R105.1
!COL40: C49.2 IC43.2(I) R107.1
!COL41: C50.2 IC44.2(I) R109.1
!COL42: C51.2 IC45.2(I) R111.1
!COL43: C52.2 IC46.2(I) R113.1
!COL44: C53.2 IC47.2(I) R115.1
!COL45: C54.2 IC48.2(I) R117.1
!COL46: C55.2 IC49.2(I) R119.1
!COL47: C56.2 IC50.2(I) R121.1
!COL48: C57.2 IC51.2(I) R123.1
!COL49: C58.2 IC52.2(I) R125.1
!COL50: C59.2 IC53.2(I) R127.1
!COL51: C60.2 IC54.2(I) R129.1
!COL52: C61.2 IC55.2(I) R131.1
!COL53: C62.2 IC56.2(I) R133.1
!COL54: C63.2 IC57.2(I) R135.1
!COL55: C64.2 IC58.2(I) R137.1
!COL56: C65.2 IC59.2(I) R139.1
!COL57: C66.2 IC60.2(I) R141.1
!COL58: C67.2 IC61.2(I) R143.1
!COL59: C68.2 IC62.2(I) R145.1
!COL60: C69.2 IC63.2(I) R147.1
!COL61: C70.2 IC64.2(I) R149.1
!COL62: C71.2 IC65.2(I) R151.1
!COL63: C72.2 IC66.2(I) R153.1
!COL64: C73.2 IC67.2(I) R155.1
!COL65: C74.2 IC68.2(I) R157.1
!COL66: C75.2 IC69.2(I) R159.1
!COL67: C76.2 IC70.2(I) R161.1
!COL68: C77.2 IC71.2(I) R163.1
!COL69: C78.2 IC72.2(I) R165.1
!E1: U$1.1(PE6) U$2.4(/E1) U$3.4(/E1)
+3V3: C6.2 C7.2 C8.2 IC1.5(VCC) IC2.5(VCC) IC3.32(VCC) IC4.32(VCC) IC5.5(VCC) IC6.5(VCC) IC7.5(VCC) IC8.5(VCC) IC9.5(VCC) IC10.5(VCC) IC11.5(VCC) IC12.5(VCC) IC13.5(VCC) IC14.5(VCC) IC15.5(VCC) IC16.5(VCC) IC17.5(VCC) IC18.5(VCC) IC19.5(VCC) IC20.5(VCC) IC21.5(VCC) IC22.5(VCC) IC23.5(VCC) IC24.5(VCC) IC25.5(VCC) IC26.5(VCC) IC27.5(VCC) IC28.5(VCC) IC29.5(VCC) IC30.5(VCC) IC31.5(VCC) IC32.5(VCC) IC33.5(VCC) IC34.5(VCC) IC35.5(VCC) IC36.5(VCC) IC37.5(VCC) IC38.5(VCC) IC39.5(VCC) IC40.5(VCC) IC41.5(VCC) IC42.5(VCC) IC43.5(VCC) IC44.5(VCC) IC45.5(VCC) IC46.5(VCC) IC47.5(VCC) IC48.5(VCC) IC49.5(VCC) IC50.5(VCC) IC51.5(VCC) IC52.5(VCC) IC53.5(VCC) IC54.5(VCC) IC55.5(VCC) IC56.5(VCC) IC57.5(VCC) IC58.5(VCC) IC59.5(VCC) IC60.5(VCC) IC61.5(VCC) IC62.5(VCC) IC63.5(VCC) IC64.5(VCC) IC65.5(VCC) IC66.5(VCC) IC67.5(VCC) IC68.5(VCC) IC69.5(VCC) IC70.5(VCC) IC71.5(VCC) IC72.5(VCC) IC73.4(OUT) J1.2 J2.6 R27.2 R28.2 R30.2 R32.2 R34.2 R36.2 R38.2 R40.2 R42.2 R44.2 R46.2 R48.2 R50.2 R52.2 R54.2 R56.2 R58.2 R60.2 R62.2 R64.2 R66.2 R68.2 R70.2 R72.2 R74.2 R76.2 R78.2 R80.2 R82.2 R84.2 R86.2 R88.2 R90.2 R92.2 R94.2 R96.2 R98.2 R100.2 R102.2 R104.2 R106.2 R108.2 R110.2 R112.2 R114.2 R116.2 R118.2 R120.2 R122.2 R124.2 R126.2 R128.2 R130.2 R132.2 R134.2 R136.2 R138.2 R140.2 R142.2 R144.2 R146.2 R148.2 R150.2 R152.2 R154.2 R156.2 R158.2 R160.2 R162.2 R164.2 U$1.14(VCC) U$1.24(AVCC) U$1.34(VCC) U$1.44(AVCC) U$2.6(E3) U$2.16(VCC) U$3.16(VCC)
A0: U$1.28(PB4(ADC11)) U$2.1(A0) U$3.1(A0)
A1: U$1.29(PB5(ADC12)) U$2.2(A1) U$3.2(A1)
A2: U$1.30(PB6(ADC13)) U$2.3(A2) U$3.3(A2)
A3: U$1.12(PB7) U$2.5(/E2) U$3.6(E3)
BLANK: IC3.2(BLANK) IC4.2(BLANK) U$1.8(PB0(SS))
D+: JP1.D+ JP2.D+ JP3.D+ JP4.D+ R2.1 USB.3
D-: JP1.D- JP2.D- JP3.D- JP4.D- R3.1 USB.2
GND: C1.1 C2.1 C3.1 C4.1 C5.1 C6.1 C7.1 C8.1 C81.2 C82.1 D76.3(E) D77.3(E) D78.3(E) D79.3(E) D80.3(E) IC1.3(GND) IC2.3(GND) IC3.1(GND) IC3.PAD IC4.1(GND) IC4.PAD IC5.3(GND) IC6.3(GND) IC7.3(GND) IC8.3(GND) IC9.3(GND) IC10.3(GND) IC11.3(GND) IC12.3(GND) IC13.3(GND) IC14.3(GND) IC15.3(GND) IC16.3(GND) IC17.3(GND) IC18.3(GND) IC19.3(GND) IC20.3(GND) IC21.3(GND) IC22.3(GND) IC23.3(GND) IC24.3(GND) IC25.3(GND) IC26.3(GND) IC27.3(GND) IC28.3(GND) IC29.3(GND) IC30.3(GND) IC31.3(GND) IC32.3(GND) IC33.3(GND) IC34.3(GND) IC35.3(GND) IC36.3(GND) IC37.3(GND) IC38.3(GND) IC39.3(GND) IC40.3(GND) IC41.3(GND) IC42.3(GND) IC43.3(GND) IC44.3(GND) IC45.3(GND) IC46.3(GND) IC47.3(GND) IC48.3(GND) IC49.3(GND) IC50.3(GND) IC51.3(GND) IC52.3(GND) IC53.3(GND) IC54.3(GND) IC55.3(GND) IC56.3(GND) IC57.3(GND) IC58.3(GND) IC59.3(GND) IC60.3(GND) IC61.3(GND) IC62.3(GND) IC63.3(GND) IC64.3(GND) IC65.3(GND) IC66.3(GND) IC67.3(GND) IC68.3(GND) IC69.3(GND) IC70.3(GND) IC71.3(GND) IC72.3(GND) IC73.2(GND) J1.6 J2.1 JP1.GND JP2.GND JP3.GND JP4.GND R1.1 R4.2 R5.2 R16.1 R17.1 R18.1 R19.1 R20.1 R168.1 S71.1 S71.2 U$1.5(UGND) U$1.15(GND) U$1.23(GND) U$1.35(GND) U$1.43(GND) U$2.8(GND) U$3.5(/E2) U$3.8(GND) USB.1 Y1.2(GND) Y1.4(GND)
LED-A0: J3.1 R21.1
LED-A1: J3.2 R22.1
LED-A2: J3.3 R23.1
LED-A3: J3.4 R24.1
LED-A4: J3.5 R25.1
LED-B0: IC3.7(OUT2) S1.D2 S16.D2 S31.D2 S46.D2 S61.D2
LED-B1: IC3.10(OUT5) S2.D2 S17.D2 S32.D2 S47.D2
LED-B2: IC3.13(OUT8) S3.D2 S18.D2 S33.D2 S48.D2 S62.D2
LED-B3: IC3.16(OUT11) S4.D2 S19.D2 S34.D2 S49.D2 S63.D2
LED-B4: IC3.19(OUT14) S5.D2 S20.D2 S35.D2 S50.D2
LED-B5: IC3.22(OUT17) S6.D2 S21.D2 S36.D2 S51.D2 S64.D2
LED-B6: IC3.25(OUT20) S7.D2 S22.D2 S37.D2 S52.D2 S65.D2
LED-B7: IC3.28(OUT23) S8.D2 S23.D2 S38.D2 S53.D2
LED-B8: IC4.10(OUT5) S9.D2 S24.D2 S39.D2 S54.D2 S66.D2
LED-B9: IC4.13(OUT8) S10.D2 S25.D2 S40.D2 S55.D2 S67.D2
LED-B10: IC4.16(OUT11) S11.D2 S26.D2 S41.D2 S56.D2
LED-B11: IC4.19(OUT14) S12.D2 S27.D2 S42.D2 S57.D2 S68.D2
LED-B12: IC4.22(OUT17) S13.D2 S28.D2 S43.D2 S58.D2 S69.D2
LED-B13: IC4.25(OUT20) S14.D2 S29.D2 S44.D2 S59.D2
LED-B14: IC4.28(OUT23) S15.D2 S30.D2 S45.D2 S60.D2 S70.D2
LED-G0: IC3.5(OUT0) S1.D1 S16.D1 S31.D1 S46.D1 S61.D1
LED-G1: IC3.8(OUT3) S2.D1 S17.D1 S32.D1 S47.D1
LED-G2: C70.1 IC3.11(OUT6) S3.D1 S18.D1 S33.D1 S48.D1 S62.D1
LED-G3: IC3.14(OUT9) S4.D1 S19.D1 S34.D1 S49.D1 S63.D1
LED-G4: IC3.17(OUT12) S5.D1 S20.D1 S35.D1 S50.D1
LED-G5: C72.1 IC3.20(OUT15) S6.D1 S21.D1 S36.D1 S51.D1 S64.D1
LED-G6: IC3.23(OUT18) S7.D1 S22.D1 S37.D1 S52.D1 S65.D1
LED-G7: IC3.26(OUT21) S8.D1 S23.D1 S38.D1 S53.D1
LED-G8: C74.1 IC4.8(OUT3) S9.D1 S24.D1 S39.D1 S54.D1 S66.D1
LED-G9: IC4.11(OUT6) S10.D1 S25.D1 S40.D1 S55.D1 S67.D1
LED-G10: IC4.14(OUT9) S11.D1 S26.D1 S41.D1 S56.D1
LED-G11: C76.1 IC4.17(OUT12) S12.D1 S27.D1 S42.D1 S57.D1 S68.D1
LED-G12: IC4.20(OUT15) S13.D1 S28.D1 S43.D1 S58.D1 S69.D1
LED-G13: IC4.23(OUT18) S14.D1 S29.D1 S44.D1 S59.D1
LED-G14: C78.1 IC4.26(OUT21) S15.D1 S30.D1 S45.D1 S60.D1 S70.D1
LED-R0: IC3.6(OUT1) S1.LED2 S16.LED2 S31.LED2 S46.LED2 S61.LED2
LED-R1: IC3.9(OUT4) S2.LED2 S17.LED2 S32.LED2 S47.LED2
LED-R2: IC3.12(OUT7) S3.LED2 S18.LED2 S33.LED2 S48.LED2 S62.LED2
LED-R3: IC3.15(OUT10) S4.LED2 S19.LED2 S34.LED2 S49.LED2 S63.LED2
LED-R4: IC3.18(OUT13) S5.LED2 S20.LED2 S35.LED2 S50.LED2
LED-R5: IC3.21(OUT16) S6.LED2 S21.LED2 S36.LED2 S51.LED2 S64.LED2
LED-R6: IC3.24(OUT19) S7.LED2 S22.LED2 S37.LED2 S52.LED2 S65.LED2
LED-R7: IC3.27(OUT22) S8.LED2 S23.LED2 S38.LED2 S53.LED2
LED-R8: IC4.9(OUT4) S9.LED2 S24.LED2 S39.LED2 S54.LED2 S66.LED2
LED-R9: IC4.12(OUT7) S10.LED2 S25.LED2 S40.LED2 S55.LED2 S67.LED2
LED-R10: IC4.15(OUT10) S11.LED2 S26.LED2 S41.LED2 S56.LED2
LED-R11: IC4.18(OUT13) S12.LED2 S27.LED2 S42.LED2 S57.LED2 S68.LED2
LED-R12: IC4.21(OUT16) S13.LED2 S28.LED2 S43.LED2 S58.LED2 S69.LED2
LED-R13: IC4.24(OUT19) S14.LED2 S29.LED2 S44.LED2 S59.LED2
LED-R14: IC4.27(OUT22) S15.LED2 S30.LED2 S45.LED2 S60.LED2 S70.LED2
MISO: J1.1 U$1.11(PB3(MISO))
MOSI: IC3.4(SIN) J1.4 U$1.10(PB2(MOSI))
N$9: C1.2 U$1.17(XTAL1) Y1.1
N$10: C2.2 U$1.16(XTAL2) Y1.3
N$11: F1.1 JP1.VBUS JP2.VBUS JP3.VBUS JP4.VBUS
N$12: IC3.29(SOUT) IC4.4(SIN)
N$14: C81.1 IC73.3(BP)
N$17: IC1.4(O)
N$18: IC2.4(O)
N$19: IC5.4(O)
N$20: IC6.4(O)
N$22: IC7.4(O)
N$23: IC8.4(O)
N$24: IC9.4(O)
N$25: IC10.4(O)
N$26: IC11.4(O)
N$27: IC12.4(O)
N$28: IC13.4(O)
N$29: IC14.4(O)
N$33: R1.2 U$1.33(PE2/!HWB)
N$34: C3.2 U$1.6(UCAP)
N$35: C5.2 U$1.42(AREF)
N$36: R2.2 U$1.4(D+)
N$44: R3.2 U$1.3(D-)
N$46: IC3.31(IREF) R4.1
N$47: IC4.31(IREF) R5.1
N$50: D71.1(G) R6.1 R11.2
N$51: D71.3(D) S1.LED1 S2.LED1 S3.LED1 S4.LED1 S5.LED1 S6.LED1 S7.LED1 S8.LED1 S9.LED1 S10.LED1 S11.LED1 S12.LED1 S13.LED1 S14.LED1 S15.LED1
N$55: D72.3(D) S16.LED1 S17.LED1 S18.LED1 S19.LED1 S20.LED1 S21.LED1 S22.LED1 S23.LED1 S24.LED1 S25.LED1 S26.LED1 S27.LED1 S28.LED1 S29.LED1 S30.LED1
N$61: D73.3(D) S31.LED1 S32.LED1 S33.LED1 S34.LED1 S35.LED1 S36.LED1 S37.LED1 S38.LED1 S39.LED1 S40.LED1 S41.LED1 S42.LED1 S43.LED1 S44.LED1 S45.LED1
N$63: D74.3(D) S46.LED1 S47.LED1 S48.LED1 S49.LED1 S50.LED1 S51.LED1 S52.LED1 S53.LED1 S54.LED1 S55.LED1 S56.LED1 S57.LED1 S58.LED1 S59.LED1 S60.LED1
N$69: D75.1(G) R10.1 R15.2
N$70: D74.1(G) R9.1 R14.2
N$74: D73.1(G) R8.1 R13.2
N$75: D72.1(G) R7.1 R12.2
N$78: D75.3(D) S61.LED1 S62.LED1 S63.LED1 S64.LED1 S65.LED1 S66.LED1 S67.LED1 S68.LED1 S69.LED1 S70.LED1
N$82: D76.2(C) R11.1
N$83: D77.1(B) R17.2 R22.2
N$87: D79.2(C) R14.1
N$90: D78.2(C) R13.1
N$94: D77.2(C) R12.1
N$95: D80.2(C) R15.1
N$104: IC15.4(O)
N$105: D76.1(B) R16.2 R21.2
N$106: D78.1(B) R18.2 R23.2
N$107: D79.1(B) R19.2 R24.2
N$108: D80.1(B) R20.2 R25.2
N$109: IC16.4(O)
N$110: IC17.4(O)
N$112: IC18.4(O)
N$113: IC19.4(O)
N$114: IC20.4(O)
N$115: IC21.4(O)
N$116: IC22.4(O)
N$117: IC23.4(O)
N$118: IC24.4(O)
N$119: IC25.4(O)
N$120: IC26.4(O)
N$121: IC27.4(O)
N$122: IC28.4(O)
N$123: IC29.4(O)
N$124: IC30.4(O)
N$125: IC31.4(O)
N$126: IC32.4(O)
N$130: IC33.4(O)
N$131: IC34.4(O)
N$132: IC35.4(O)
N$133: IC36.4(O)
N$134: IC37.4(O)
N$135: IC38.4(O)
N$136: IC39.4(O)
N$137: IC40.4(O)
N$138: IC41.4(O)
N$139: IC42.4(O)
N$140: IC43.4(O)
N$141: IC44.4(O)
N$142: IC45.4(O)
N$143: IC46.4(O)
N$144: IC47.4(O)
N$148: IC48.4(O)
N$149: IC49.4(O)
N$150: IC50.4(O)
N$151: IC51.4(O)
N$152: IC52.4(O)
N$153: IC53.4(O)
N$154: IC54.4(O)
N$155: IC55.4(O)
N$156: IC56.4(O)
N$157: IC57.4(O)
N$158: IC58.4(O)
N$159: IC59.4(O)
N$160: IC60.4(O)
N$161: IC61.4(O)
N$162: IC62.4(O)
N$166: IC63.4(O)
N$167: IC64.4(O)
N$168: IC65.4(O)
N$169: IC66.4(O)
N$170: IC67.4(O)
N$171: IC68.4(O)
N$172: IC69.4(O)
N$173: IC70.4(O)
N$174: IC71.4(O)
N$175: IC72.4(O)
R0: D1.C D2.C D3.C D4.C D5.C D6.C D7.C D8.C D9.C D10.C D11.C D12.C D13.C D14.C D15.C
R1: D16.C D17.C D18.C D19.C D20.C D21.C D22.C D23.C D24.C D25.C D26.C D27.C D28.C D29.C D30.C
R2: D31.C D32.C D33.C D34.C D35.C D36.C D37.C D38.C D39.C D40.C D41.C D42.C D43.C D44.C D45.C
R3: D46.C D47.C D48.C D49.C D50.C D51.C D52.C D53.C D54.C D55.C D56.C D57.C D58.C D59.C D60.C
R4: D61.C D62.C D63.C D64.C D65.C D66.C D67.C D68.C D69.C D70.C
RST: J1.5 S71.3 S71.4 U$1.13(!RESET)
RX: J2.4 U$1.20(PD2(RX))
SCK: IC3.3(SCLK) IC4.3(SCLK) J1.3 U$1.9(PB1(SCK))
SOUT: IC4.29(SOUT) J3.6
SW1: D1.A R26.2 R27.1 S1.SW2 S1.SW4(SW2)
SW2: D2.A R28.1 R29.2 S2.SW2 S2.SW4(SW2)
SW3: D3.A R30.1 R31.2 S3.SW2 S3.SW4(SW2)
SW4: D4.A R32.1 R33.2 S4.SW2 S4.SW4(SW2)
SW5: D5.A R34.1 R35.2 S5.SW2 S5.SW4(SW2)
SW6: D6.A R36.1 R37.2 S6.SW2 S6.SW4(SW2)
SW7: D7.A R38.1 R39.2 S7.SW2 S7.SW4(SW2)
SW8: D8.A R40.1 R41.2 S8.SW2 S8.SW4(SW2)
SW9: D9.A R42.1 R43.2 S9.SW2 S9.SW4(SW2)
SW10: D10.A R44.1 R45.2 S10.SW2 S10.SW4(SW2)
SW11: D11.A R46.1 R47.2 S11.SW2 S11.SW4(SW2)
SW12: D12.A R48.1 R49.2 S12.SW2 S12.SW4(SW2)
SW13: D13.A R50.1 R51.2 S13.SW2 S13.SW4(SW2)
SW14: D14.A R52.1 R53.2 S14.SW2 S14.SW4(SW2)
SW15: D15.A R54.1 R55.2 S15.SW2 S15.SW4(SW2)
SW16: D16.A R56.1 R57.2 S16.SW2 S16.SW4(SW2)
SW17: D17.A R58.1 R59.2 S17.SW2 S17.SW4(SW2)
SW18: D18.A R60.1 R61.2 S18.SW2 S18.SW4(SW2)
SW19: D19.A R62.1 R63.2 S19.SW2 S19.SW4(SW2)
SW20: D20.A R64.1 R65.2 S20.SW2 S20.SW4(SW2)
SW21: D21.A R66.1 R67.2 S21.SW2 S21.SW4(SW2)
SW22: D22.A R68.1 R69.2 S22.SW2 S22.SW4(SW2)
SW23: D23.A R70.1 R71.2 S23.SW2 S23.SW4(SW2)
SW24: D24.A R72.1 R73.2 S24.SW2 S24.SW4(SW2)
SW25: D25.A R74.1 R75.2 S25.SW2 S25.SW4(SW2)
SW26: D26.A R76.1 R77.2 S26.SW2 S26.SW4(SW2)
SW27: D27.A R78.1 R79.2 S27.SW2 S27.SW4(SW2)
SW28: D28.A R80.1 R81.2 S28.SW2 S28.SW4(SW2)
SW29: D29.A R82.1 R83.2 S29.SW2 S29.SW4(SW2)
SW30: D30.A R84.1 R85.2 S30.SW2 S30.SW4(SW2)
SW31: D31.A R86.1 R87.2 S31.SW2 S31.SW4(SW2)
SW32: D32.A R88.1 R89.2 S32.SW2 S32.SW4(SW2)
SW33: D33.A R90.1 R91.2 S33.SW2 S33.SW4(SW2)
SW34: D34.A R92.1 R93.2 S34.SW2 S34.SW4(SW2)
SW35: D35.A R94.1 R95.2 S35.SW2 S35.SW4(SW2)
SW36: D36.A R96.1 R97.2 S36.SW2 S36.SW4(SW2)
SW37: D37.A R98.1 R99.2 S37.SW2 S37.SW4(SW2)
SW38: D38.A R100.1 R101.2 S38.SW2 S38.SW4(SW2)
SW39: D39.A R102.1 R103.2 S39.SW2 S39.SW4(SW2)
SW40: D40.A R104.1 R105.2 S40.SW2 S40.SW4(SW2)
SW41: D41.A R106.1 R107.2 S41.SW2 S41.SW4(SW2)
SW42: D42.A R108.1 R109.2 S42.SW2 S42.SW4(SW2)
SW43: D43.A R110.1 R111.2 S43.SW2 S43.SW4(SW2)
SW44: D44.A R112.1 R113.2 S44.SW2 S44.SW4(SW2)
SW45: D45.A R114.1 R115.2 S45.SW2 S45.SW4(SW2)
SW46: D46.A R116.1 R117.2 S46.SW2 S46.SW4(SW2)
SW47: D47.A R118.1 R119.2 S47.SW2 S47.SW4(SW2)
SW48: D48.A R120.1 R121.2 S48.SW2 S48.SW4(SW2)
SW49: D49.A R122.1 R123.2 S49.SW2 S49.SW4(SW2)
SW50: D50.A R124.1 R125.2 S50.SW2 S50.SW4(SW2)
SW51: D51.A R126.1 R127.2 S51.SW2 S51.SW4(SW2)
SW52: D52.A R128.1 R129.2 S52.SW2 S52.SW4(SW2)
SW53: D53.A R130.1 R131.2 S53.SW2 S53.SW4(SW2)
SW54: D54.A R132.1 R133.2 S54.SW2 S54.SW4(SW2)
SW55: D55.A R134.1 R135.2 S55.SW2 S55.SW4(SW2)
SW56: D56.A R136.1 R137.2 S56.SW2 S56.SW4(SW2)
SW57: D57.A R138.1 R139.2 S57.SW2 S57.SW4(SW2)
SW58: D58.A R140.1 R141.2 S58.SW2 S58.SW4(SW2)
SW59: D59.A R142.1 R143.2 S59.SW2 S59.SW4(SW2)
SW60: D60.A R144.1 R145.2 S60.SW2 S60.SW4(SW2)
SW61: D61.A R146.1 R147.2 S61.SW2 S61.SW4(SW2)
SW62: D62.A R148.1 R149.2 S62.SW2 S62.SW4(SW2)
SW63: D63.A R150.1 R151.2 S63.SW2 S63.SW4(SW2)
SW64: D64.A R152.1 R153.2 S64.SW2 S64.SW4(SW2)
SW65: D65.A R154.1 R155.2 S65.SW2 S65.SW4(SW2)
SW66: D66.A R156.1 R157.2 S66.SW2 S66.SW4(SW2)
SW67: D67.A R158.1 R159.2 S67.SW2 S67.SW4(SW2)
SW68: D68.A R160.1 R161.2 S68.SW2 S68.SW4(SW2)
SW69: D69.A R162.1 R163.2 S69.SW2 S69.SW4(SW2)
SW70: D70.A R164.1 R165.2 S70.SW2 S70.SW4(SW2)
TX: J2.3 U$1.21(PD3(TX))
UVCC: C4.2 U$1.2(UVCC) U$1.7(VBUS)
VBAT: J2.2 Q1.3(D)
VCC: C82.2 D81.C IC73.1(EN) IC73.5(IN) Q1.2(S)
VIN: D71.2(S) D72.2(S) D73.2(S) D74.2(S) D75.2(S) D81.A F1.2 J2.5 Q1.1(G) R6.2 R7.2 R8.2 R9.2 R10.2 R168.2 USB.4
XLAT: IC3.30(XLAT) IC4.30(XLAT)
Unconnected: IC4.5(OUT0) IC4.6(OUT1) IC4.7(OUT2) JP1.ID JP2.ID JP3.ID JP4.ID U$1.18(PD0(SCL)) U$1.19(PD1(SDA)) U$1.22(PD5) U$1.25(PD4(ADC8)) U$1.26(PD6(ADC9)) U$1.27(PD7(ADC10)) U$1.31(PC6) U$1.32(PC7) U$1.36(PF7(ADC7)) U$1.37(PF6(ADC6)) U$1.38(PF5(ADC5)) U$1.39(PF4(ADC4)) U$1.40(PF1(ADC1)) U$1.41(PF0(ADC0)) U$3.15(/Y0)

## Notes on the sheet
- check these
- change these
  (74hc595?)
- check xtal package
- check values
  and packages

## Library data of the parts
C1-C78 C81 C82 = Jordi:CAPACITOR
D1-D70 = SparkFun-DiscreteSemi:DIODE: Diode These are standard reverse protection diodes and small signal diodes. SMA package can handle up to about 1A. SOD-323 can handle about 200mA. What the SOD-323 package when ordering, there are some mfgs out there that are 5-pin packages.
D71-D75 Q1 = Jordi:MOSFET-P
D76-D80 = Jordi:BSS138: A standard N-Channel (NPN) transistor
D81 = SparkFun-DiscreteSemi:DIODE-SCHOTTKY: Schottky diodes in SFE's production catalog BAT20J 1A 23V 0.62Vf RB751 120mA 40V 0.37Vf PMEG4005EJ 0.5A 40V 0.42Vf MBRA140 1A 40V 0.5Vf B340A 3A 40V SMA; PROD_ID: DIO-11623
F1 = Jordi:FUSE
IC1 IC2 IC5-IC72 = 74xx-little-us:74*1G14: Single Schmitt-Trigger Inverter Gate
IC3 IC4 = Jordi:TLC5947: A 24-channel high resolution PWM IC
IC73 = Jordi:VREG-5
J1 = Jordi:2X03
J2 J3 = Jordi:1X06
JP1-JP4 = Jordi:USB-MICROB
R1-R165 R168 = Jordi:RESISTOR
S1-S70 = Jordi:CHERRY-MX-LED: Cherry MX series keyswitch with LED. Also compatible with Alps/Matias switches.
S71 = Jordi:SWITCH-TACTILE
U$1 = SparkFun-DigitalIC:ATMEGA32U4: Atmel 44-pin 8-bit Microcontroller with 32KBytes of ISP Flash and USB Controller
U$2 U$3 = SparkFun-DigitalIC:74LVC138AD: 3-to-8 decoder
USB = Jordi:1X04
Y1 = Jordi:CRYSTAL